# EAGLE design clock-converter (EAGLE 7.6.0)
REVISION: v1
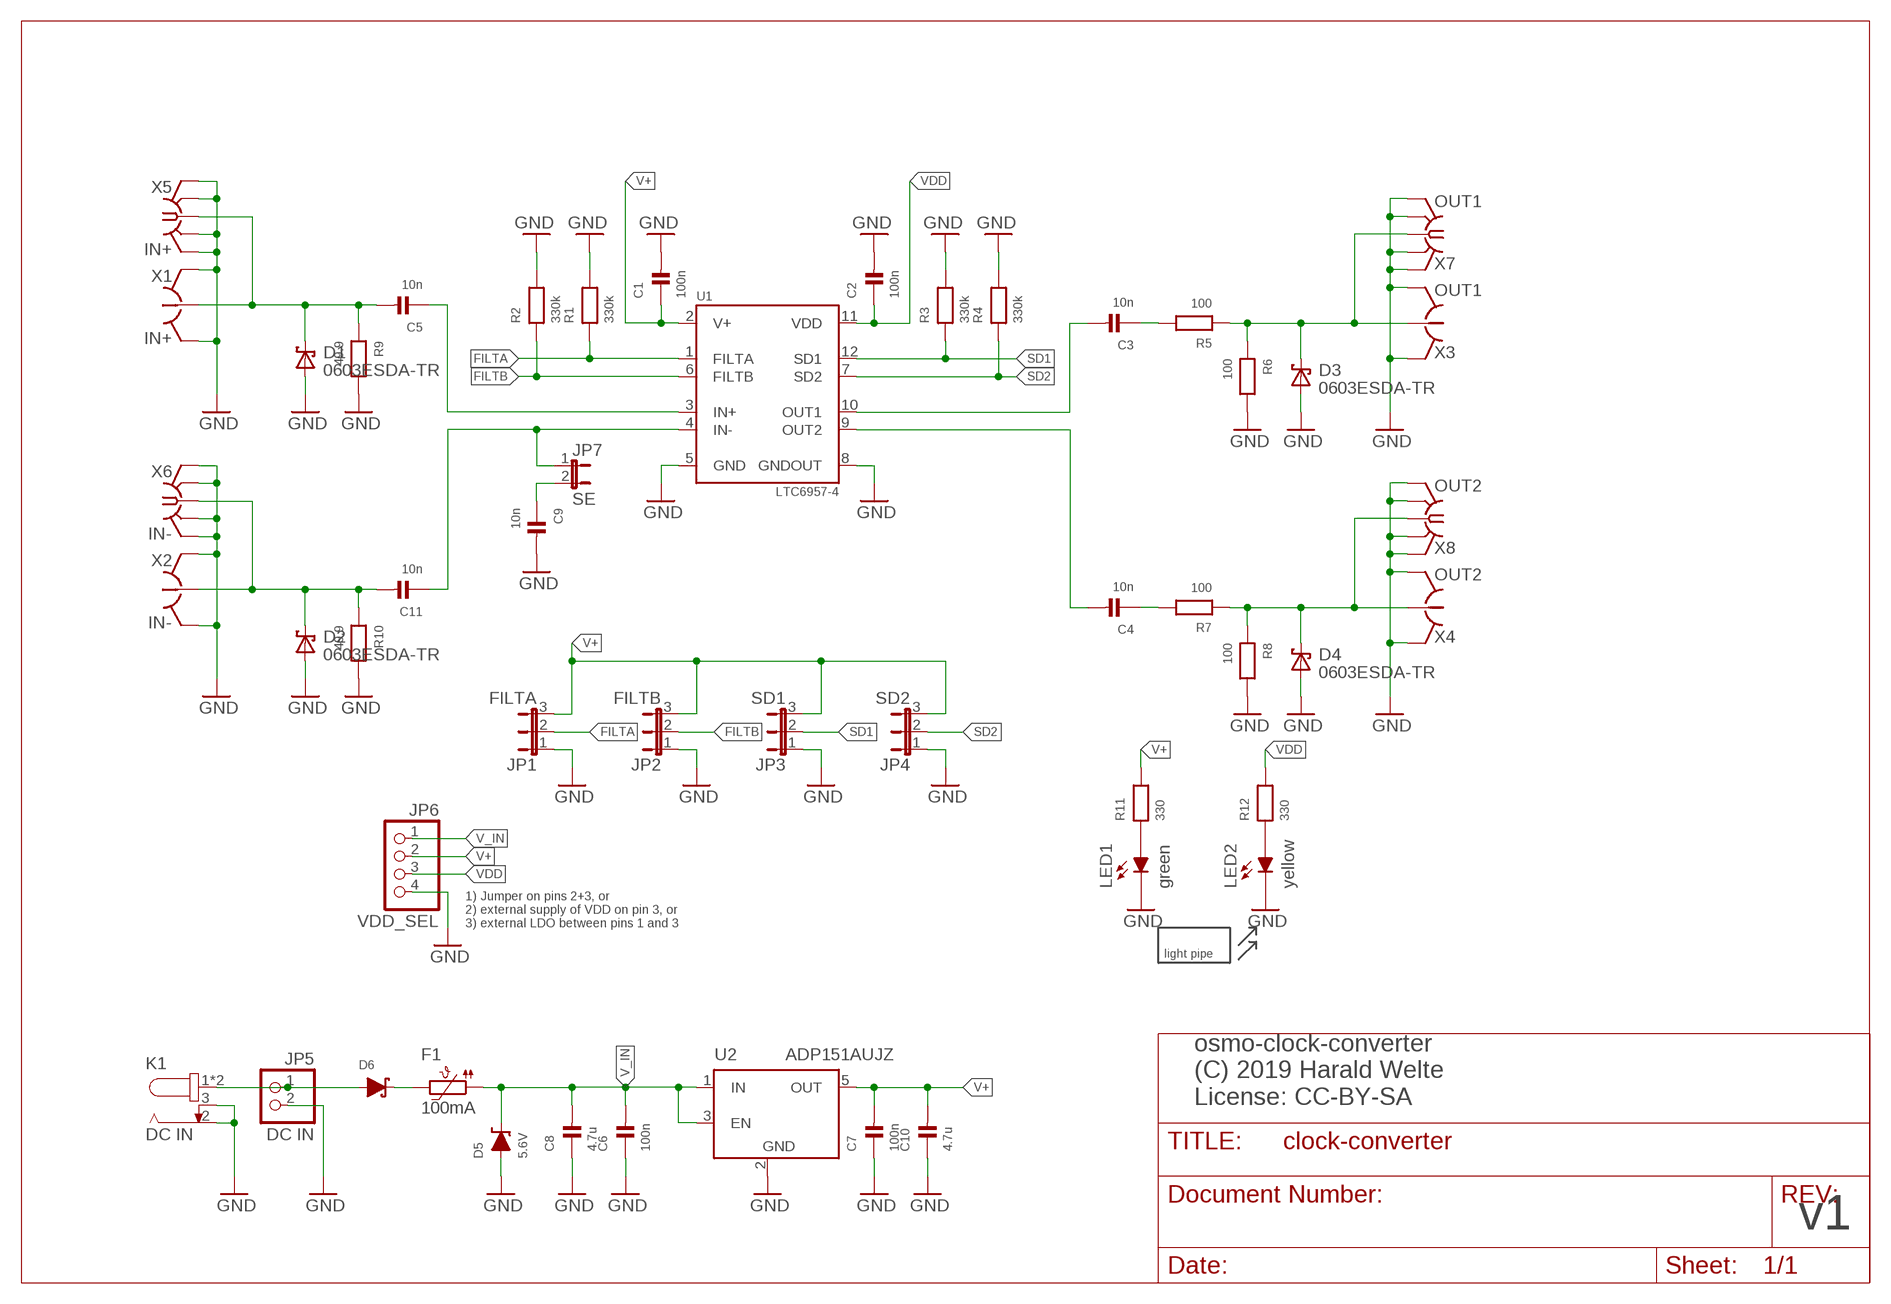
[diagram p0: schematic, sheet 1]

## Parts
C1  100n  CAP_CERAMIC_0603  [_0603]
C2  100n  CAP_CERAMIC_0603  [_0603]
C3  10n  CAP_CERAMIC_0603  [_0603]
C4  10n  CAP_CERAMIC_0603  [_0603]
C5  10n  CAP_CERAMIC_0603  [_0603]
C6  100n  CAP_CERAMIC_0603  [_0603]
C7  100n  CAP_CERAMIC_0603  [_0603]
C8  4.7u  CAP_CERAMIC_0805  [_0805]
C9  10n  CAP_CERAMIC_0603  [_0603]
C10  4.7u  CAP_CERAMIC_0805  [_0805]
C11  10n  CAP_CERAMIC_0603  [_0603]
D1  0603ESDA-TR  [0603]
D2  0603ESDA-TR  [0603]
D3  0603ESDA-TR  [0603]
D4  0603ESDA-TR  [0603]
D5  5.6V  DIODDE-ZENER-SMA  [SMADIODE]
D6  DIODE-SCHOTTKY-SMA  [SMADIODE]
F1  100mA  POLYFUSE-1206L  [1206L]
JP1  FILTA  JP2E  [JP2]
JP2  FILTB  JP2E  [JP2]
JP3  SD1  JP2E  [JP2]
JP4  SD2  JP2E  [JP2]
JP5  DC IN  PINHD-1X2  [1X02]
JP6  VDD_SEL  PINHD-1X4  [1X04]
JP7  SE  JP1E  [JP1]
K1  DC IN  694108106102  [694108106102]
LED1  green  LEDPLCC2-MIN  [PLCC2-MIN]
LED2  yellow  LEDPLCC2-MIN  [PLCC2-MIN]
M1  MENTOR_12701001  [1270.1001]
R1  330k  RESISTOR_0603  [_0603]
R2  330k  RESISTOR_0603  [_0603]
R3  330k  RESISTOR_0603  [_0603]
R4  330k  RESISTOR_0603  [_0603]
R5  100  RESISTOR_0603  [_0603]
R6  100  RESISTOR_0603  [_0603]
R7  100  RESISTOR_0603  [_0603]
R8  100  RESISTOR_0603  [_0603]
R9  49.9  RESISTOR_0603  [_0603]
R10  49.9  RESISTOR_0603  [_0603]
R11  330  RESISTOR_0603  [_0603]
R12  330  RESISTOR_0603  [_0603]
U1  LTC6957-4  LTC6957-3/4-HMS  [MSOP12]
U2  ADP151AUJZ  LDO_FIXED_EN-ADP151AUJZ  [SOT23L]
X1  IN+  HRS_UFL  [HRS_UFL]
X2  IN-  HRS_UFL  [HRS_UFL]
X3  OUT1  HRS_UFL  [HRS_UFL]
X4  OUT2  HRS_UFL  [HRS_UFL]
X5  IN+  SMA-F-S-TH  [SMA-F-S-TH]
X6  IN-  SMA-F-S-TH  [SMA-F-S-TH]
X7  OUT1  SMA-F-S-TH  [SMA-F-S-TH]
X8  OUT2  SMA-F-S-TH  [SMA-F-S-TH]

## Nets
FILTA: JP1.2 R1.1 U1.1(FILTA)
FILTB: JP2.2 R2.1 U1.6(FILTB)
GND [supply]: C1.2 C2.2 C6.1 C7.1 C8.1 C9.2 C10.1 D1.1(A) D2.1(A) D3.1(A) D4.1(A) D5.A JP1.1 JP2.1 JP3.1 JP4.1 JP5.2 JP6.4 K1.2 K1.3 LED1.K(C) LED2.K(C) R1.2 R2.2 R3.2 R4.2 R6.2 R8.2 R9.2 R10.2 U1.5(GND) U1.8(GNDOUT) U2.2(GND) X1.GND@1(GND) X1.GND@2(GND) X2.GND@1(GND) X2.GND@2(GND) X3.GND@1(GND) X3.GND@2(GND) X4.GND@1(GND) X4.GND@2(GND) X5.G1(GND) X5.G2(GND) X5.G3(GND) X5.G4(GND) X6.G1(GND) X6.G2(GND) X6.G3(GND) X6.G4(GND) X7.G1(GND) X7.G2(GND) X7.G3(GND) X7.G4(GND) X8.G1(GND) X8.G2(GND) X8.G3(GND) X8.G4(GND)
IN+ [50ohms]: C5.1 U1.3(IN+)
N$1: LED1.A R11.1
N$2 [50ohms]: C3.2 U1.10(OUT1)
N$3: LED2.A R12.1
N$4: C9.1 JP7.2
N$5 [supply]: D6.C F1.2
N$6 [50ohms]: C3.1 R5.2
N$7 [50ohms]: C11.1 JP7.1 U1.4(IN-)
N$8 [50ohms]: C4.2 U1.9(OUT2)
N$9 [50ohms]: C4.1 R7.2
N$10 [50ohms]: C11.2 D2.2(K) R10.1 X2.SIG X6.C
N$12 [50ohms]: C5.2 D1.2(K) R9.1 X1.SIG X5.C
N$14 [supply]: D6.A JP5.1 K1.1 K1.1-1
OUT1 [50ohms]: D3.2(K) R5.1 R6.1 X3.SIG X7.C
OUT2 [50ohms]: D4.2(K) R7.1 R8.1 X4.SIG X8.C
SD1: JP3.2 R3.1 U1.12(SD1)
SD2: JP4.2 R4.1 U1.7(SD2)
V+ [supply]: C1.1 C7.2 C10.2 JP1.3 JP2.3 JP3.3 JP4.3 JP6.2 R11.2 U1.2(V+) U2.5(OUT)
V_IN [supply]: C6.2 C8.2 D5.C F1.1 JP6.1 U2.1(IN) U2.3(EN)
VDD [supply]: C2.1 JP6.3 R12.2 U1.11(VDD)

## Notes on the sheet
- 1) Jumper on pins 2+3, or
  2) external supply of VDD on pin 3, or
  3) external LDO between pins 1 and 3
- osmo-clock-converter
  (C) 2019 Harald Welte
  License: CC-BY-SA

## Library data of the parts
C1 C2 C6 C7 = rc-sysmocom:CAP_CERAMIC: Ceramic Capacitors 0402 - 0402 Surface Mount Capacitors 16pF 50V 5% [Digikey: 445-4899-2-ND] 18pF 50V 5% [Digikey: 490-1281-2-ND] 22pF 50V 5% [Digikey: 490-1283-2-ND] 68pF 50V 5% [Digikey: 490-1289-2-ND] 0.1uF 10V 10% [Digikey: 490-1318-2-ND] 1.0uF 6.3V 10% [Digikey: 490-1320-2-ND] 0603 - 0603 Surface Mount Capacitors 16 pF 50V 5% [Digikey: 445-5051-2-ND] 22 pF 50V [Digikey: PCC220ACVTR-ND] 33 pF 50V 5% [Digikey: 490-1415-1-ND] 56pF 50V 5% [Digikey: 490-1421-1-ND] 220pF 50V 5% [Digikey: 445-1285-1-ND] 680 pF 50V 2200 pF 50V 5% C0G [Digikey: 445-1297-1-ND] 5600 pF 100V 5% X7R [Digikey: 478-3711-1-ND] 0.1 µF 25V 10% [Digikey: PCC2277TR-ND] 0.22 µF 16V 10% X7R [Digikey: 445-1318-1-ND] 1.0 µF 25V 10% [Digikey: 445-5146-2-ND] 0603 - RF Specific 3pF 250V +/-0.1pF RF [Digikey: 712-1347-1-ND] 18 pF 250V 5% [Digikey: 478-3505-1-ND or 712-1322-1-ND] 56 pF 250V 5% C0G RF [Digikey: 490-4867-1-ND] 68 pF 250V RF [Digikey: 490-4868-1-ND] 0805 - 0805 Surface Mount Capacitors 220 pF 250V 2% RF Ceramic Capacitor [Digikey: 712-1398-1-ND] 1000 pF 50V 2% NP0 Ceramic Capacitor [Digikey: 478-3760-1-ND] 0.1 µF 25V 10% Ceramic Capacitor [Digikey: PCC1828TR-ND] 1.0 µF 16V 10% Ceramic Capacitor[Digikey: 490-1691-2-ND] 10.0 µF 10V 10% Ceramic Capacitor[Digikey: 709-1228-1-ND] 10.0 uF 16V 10% Ceramic Capacitor [Digikey: 478-5165-2-ND] 47 uF 6.3V 20% Ceramic Capacitor [Digikey: 587-1779-1-ND or 399-5506-1-ND] 1206 - 1206 Surface Mount Capacitors 47uF 10V 20% Ceramic Capacitor [Digikey: 490-5528-1-ND or 399-5508-1-ND or 445-6010-1-ND] 100uF 6.3V -20%, +80% Y5V Ceramic Capacitor (Digikey: 490-4512-1-ND, Mouser: 81-GRM31CF50J107ZE1L) 1810 - 1810 Surface Mount Capacitors High volt MLC; no solder stop between for higher isolation; CLASS: CAPACITOR; DESCRIPTION: CAP CER 0.1UF 16V X7R 0603; LINK: https://www.digikey.de/product-detail/de/samsung-electro-mechanics/CL10B104KO8NNNC/1276-1005-1-ND/3889091; MANUFACTURER: Samsung Electro-Mechanics; MANUFACTURERPARTNUMBER: CL10B104KO8NNNC; POPULATED: TRUE; ROHSCERTIFICATE: Bleifrei / RoHS-konform; SOURCE: DIGIKEY; SOURCEPARTNUMBER: 1276-1005-1-ND
C3-C5 C9 C11 = rc-sysmocom:CAP_CERAMIC: Ceramic Capacitors 0402 - 0402 Surface Mount Capacitors 16pF 50V 5% [Digikey: 445-4899-2-ND] 18pF 50V 5% [Digikey: 490-1281-2-ND] 22pF 50V 5% [Digikey: 490-1283-2-ND] 68pF 50V 5% [Digikey: 490-1289-2-ND] 0.1uF 10V 10% [Digikey: 490-1318-2-ND] 1.0uF 6.3V 10% [Digikey: 490-1320-2-ND] 0603 - 0603 Surface Mount Capacitors 16 pF 50V 5% [Digikey: 445-5051-2-ND] 22 pF 50V [Digikey: PCC220ACVTR-ND] 33 pF 50V 5% [Digikey: 490-1415-1-ND] 56pF 50V 5% [Digikey: 490-1421-1-ND] 220pF 50V 5% [Digikey: 445-1285-1-ND] 680 pF 50V 2200 pF 50V 5% C0G [Digikey: 445-1297-1-ND] 5600 pF 100V 5% X7R [Digikey: 478-3711-1-ND] 0.1 µF 25V 10% [Digikey: PCC2277TR-ND] 0.22 µF 16V 10% X7R [Digikey: 445-1318-1-ND] 1.0 µF 25V 10% [Digikey: 445-5146-2-ND] 0603 - RF Specific 3pF 250V +/-0.1pF RF [Digikey: 712-1347-1-ND] 18 pF 250V 5% [Digikey: 478-3505-1-ND or 712-1322-1-ND] 56 pF 250V 5% C0G RF [Digikey: 490-4867-1-ND] 68 pF 250V RF [Digikey: 490-4868-1-ND] 0805 - 0805 Surface Mount Capacitors 220 pF 250V 2% RF Ceramic Capacitor [Digikey: 712-1398-1-ND] 1000 pF 50V 2% NP0 Ceramic Capacitor [Digikey: 478-3760-1-ND] 0.1 µF 25V 10% Ceramic Capacitor [Digikey: PCC1828TR-ND] 1.0 µF 16V 10% Ceramic Capacitor[Digikey: 490-1691-2-ND] 10.0 µF 10V 10% Ceramic Capacitor[Digikey: 709-1228-1-ND] 10.0 uF 16V 10% Ceramic Capacitor [Digikey: 478-5165-2-ND] 47 uF 6.3V 20% Ceramic Capacitor [Digikey: 587-1779-1-ND or 399-5506-1-ND] 1206 - 1206 Surface Mount Capacitors 47uF 10V 20% Ceramic Capacitor [Digikey: 490-5528-1-ND or 399-5508-1-ND or 445-6010-1-ND] 100uF 6.3V -20%, +80% Y5V Ceramic Capacitor (Digikey: 490-4512-1-ND, Mouser: 81-GRM31CF50J107ZE1L) 1810 - 1810 Surface Mount Capacitors High volt MLC; no solder stop between for higher isolation; CLASS: CAPACITOR; DESCRIPTION: CAP CER 10000PF 50V X7R 0603; LINK: https://www.digikey.de/product-detail/de/kemet/C0603C103M5RACTU/399-7842-1-ND/3471565; MANUFACTURER: KEMET; MANUFACTURERPARTNUMBER: C0603C103M5RACTU; POPULATED: TRUE; ROHSCERTIFICATE: Bleifrei / RoHS-konform; SOURCE: DIGIKEY; SOURCEPARTNUMBER: 399-7842-1-ND
C8 C10 = rc-sysmocom:CAP_CERAMIC: Ceramic Capacitors 0402 - 0402 Surface Mount Capacitors 16pF 50V 5% [Digikey: 445-4899-2-ND] 18pF 50V 5% [Digikey: 490-1281-2-ND] 22pF 50V 5% [Digikey: 490-1283-2-ND] 68pF 50V 5% [Digikey: 490-1289-2-ND] 0.1uF 10V 10% [Digikey: 490-1318-2-ND] 1.0uF 6.3V 10% [Digikey: 490-1320-2-ND] 0603 - 0603 Surface Mount Capacitors 16 pF 50V 5% [Digikey: 445-5051-2-ND] 22 pF 50V [Digikey: PCC220ACVTR-ND] 33 pF 50V 5% [Digikey: 490-1415-1-ND] 56pF 50V 5% [Digikey: 490-1421-1-ND] 220pF 50V 5% [Digikey: 445-1285-1-ND] 680 pF 50V 2200 pF 50V 5% C0G [Digikey: 445-1297-1-ND] 5600 pF 100V 5% X7R [Digikey: 478-3711-1-ND] 0.1 µF 25V 10% [Digikey: PCC2277TR-ND] 0.22 µF 16V 10% X7R [Digikey: 445-1318-1-ND] 1.0 µF 25V 10% [Digikey: 445-5146-2-ND] 0603 - RF Specific 3pF 250V +/-0.1pF RF [Digikey: 712-1347-1-ND] 18 pF 250V 5% [Digikey: 478-3505-1-ND or 712-1322-1-ND] 56 pF 250V 5% C0G RF [Digikey: 490-4867-1-ND] 68 pF 250V RF [Digikey: 490-4868-1-ND] 0805 - 0805 Surface Mount Capacitors 220 pF 250V 2% RF Ceramic Capacitor [Digikey: 712-1398-1-ND] 1000 pF 50V 2% NP0 Ceramic Capacitor [Digikey: 478-3760-1-ND] 0.1 µF 25V 10% Ceramic Capacitor [Digikey: PCC1828TR-ND] 1.0 µF 16V 10% Ceramic Capacitor[Digikey: 490-1691-2-ND] 10.0 µF 10V 10% Ceramic Capacitor[Digikey: 709-1228-1-ND] 10.0 uF 16V 10% Ceramic Capacitor [Digikey: 478-5165-2-ND] 47 uF 6.3V 20% Ceramic Capacitor [Digikey: 587-1779-1-ND or 399-5506-1-ND] 1206 - 1206 Surface Mount Capacitors 47uF 10V 20% Ceramic Capacitor [Digikey: 490-5528-1-ND or 399-5508-1-ND or 445-6010-1-ND] 100uF 6.3V -20%, +80% Y5V Ceramic Capacitor (Digikey: 490-4512-1-ND, Mouser: 81-GRM31CF50J107ZE1L) 1810 - 1810 Surface Mount Capacitors High volt MLC; no solder stop between for higher isolation; CLASS: CAPACITOR; DESCRIPTION: CAP CER 4.7UF 16V X5R 0805; LINK: https://www.digikey.de/product-detail/de/samsung-electro-mechanics/CL21A475KOFNNNE/1276-1065-1-ND/3889151; MANUFACTURER: Samsung Electro-Mechanics; MANUFACTURERPARTNUMBER: CL21A475KOFNNNE; POPULATED: TRUE; ROHSCERTIFICATE: Bleifrei / RoHS-konform; SOURCE: DIGIKEY; SOURCEPARTNUMBER: 1276-1065-1-ND
D1-D4 = laforge:0603ESDA-TR: Bussmann 0603ESDA-TR ESD Suppressor; CLASS: DIODE; DESCRIPTION: SUPPRESSOR ESD 30VDC 0603 SMD; LINK: https://www.digikey.de/product-detail/de/eaton-electronics-division/0603ESDA2-TR2/283-4156-1-ND/3681415; MANUFACTURER: Eaton - Electronics Division; MANUFACTURERPARTNUMBER: 0603ESDA2-TR2; POPULATED: TRUE; ROHSCERTIFICATE: Bleifrei / RoHS-konform; SOURCE: DIGIKEY; SOURCEPARTNUMBER: 283-4156-1-ND
D5 = diodes-sysmocom:DIODDE-ZENER; CLASS: DIODE; DESCRIPTION: DIODE ZENER 5.6V 3W DO214AC; LINK: https://www.digikey.de/product-detail/de/micro-commercial-co/3SMAJ5919B-TP/3SMAJ5919B-TPMSCT-ND/1793296; MANUFACTURER: Micro Commercial Co; MANUFACTURERPARTNUMBER: 3SMAJ5919B-TP; POPULATED: TRUE; ROHSCERTIFICATE: Bleifrei / RoHS-konform; SOURCE: DIGIKEY; SOURCEPARTNUMBER: 3SMAJ5919B-TPMSCT-ND
D6 = diodes-sysmocom:DIODE-SCHOTTKY: Diode SMA Model Volts Amps Type Vf Vr Digikey # Notes SSA34-E3 40V 3A Schottky 480mV @ 3A 200uA @ 40V SSA34-E3/61TGITR-ND CDBA120-G 20V 1A Schottky 500mV @ 1A 500uA @ 20V 641-1014-6-ND REEL MBRA210 10V 2A Schottky 350mV @ 2A 700uA @ 10V MBRA210LT3 SOD-123 Model Volts Amps Type Vf Vr Order # Notes BAT54T1G 30V 200mA Schottky 800mV @ 200mA 2uA @ 25V BAT54T1GOSTR-ND B0530W 30V 500mA Schottky 430mV @ 500mA 130uA @ 30V B0530W-FDICT-ND REEL MBR120 1A 20V Schottky 340mV @ 1A MBR120VLSFT1GOSCT-ND SOD-323 Model Volts Amps Type Vf Vr Order # Notes PMEG2005EJ 20V 500mA Schottky 355mV @ 500mA 568-4110-1-ND ZLLS410 10V 570mA Schottky 380mV @ 570mA ZLLS410CT-ND 1N4148WS 75V 150mA Silicon/Simple 1V 1N4148WSFSCT-ND REEL SOD-523 Model Volts Amps Type Vf Vr Order # Notes BAT54XV2 30V 200mA Schottky 0.8V @ 100mA BAT54XV2CT-ND TB751S 30V 30mA Schottky RB751S-40TE61CT-ND SOT23-R/W (R = Solder Paste/Reflow Ovens, W = Hand-Soldering) Model Volts Amps Type Vf Vr Order # Notes BAT54FILM 40V 300mA Schottky 497-7162-1-ND; CLASS: DIODE; DESCRIPTION: DIODE SCHOTTKY 30V 800MA USC; LINK: https://www.digikey.de/product-detail/de/toshiba-semiconductor-and-storage/CUS08F30H3F/CUS08F30H3FCT-ND/5114376; MANUFACTURER: Toshiba Semiconductor and Storage; MANUFACTURERPARTNUMBER: CUS08F30,H3F; POPULATED: TRUE; ROHSCERTIFICATE: Bleifrei / RoHS-konform; SOURCE: DIGIKEY; SOURCEPARTNUMBER: CUS08F30H3FCT-ND
F1 = littlefuse:POLYFUSE; CLASS: UNKNOWN CLASS; DESCRIPTION: PTC RESET FUSE 30V 200MA 1206; LINK: https://www.digikey.de/product-detail/de/0ZCJ0020FF2E/507-1797-1-ND/4156228/?itemSeq=282618602; MANUFACTURER: Bel Fuse Inc.; MANUFACTURERPARTNUMBER: 0ZCJ0020FF2E; POPULATED: TRUE; ROHSCERTIFICATE: Bleifrei / RoHS-konform; SOURCE: DIGIKEY; SOURCEPARTNUMBER: 507-1797-1-ND
JP1-JP4 = jumper:JP2E: JUMPER; CLASS: CONNECTOR\JUMPER; DESCRIPTION: CONN HEADER VERT 3POS 2.54MM; LINK: https://www.digikey.de/product-detail/de/wurth-electronics-inc/61300311121/732-5316-ND/4846825; MANUFACTURER: Wurth Electronics Inc.; MANUFACTURERPARTNUMBER: 61300311121; POPULATED: TRUE; ROHSCERTIFICATE: Bleifrei / RoHS-konform; SOURCE: DIGIKEY; SOURCEPARTNUMBER: 732-5316-ND
JP5 = laforge:PINHD-1X2: PIN HEADER; CLASS: CONNECTOR\JUMPER; DESCRIPTION: CONN HEADER VERT 2POS 2.54MM; LINK: https://www.digikey.de/product-detail/de/PREC002SAAN-RC/S1012EC-02-ND/2774852; MANUFACTURER: Sullins Connector Solutions; MANUFACTURERPARTNUMBER: PREC002SAAN-RC; POPULATED: TRUE; ROHSCERTIFICATE: Bleifrei / RoHS-konform; SOURCE: DIGIKEY; SOURCEPARTNUMBER: S1012EC-02-ND
JP6 = pinhead:PINHD-1X4: PIN HEADER; CLASS: CONNECTOR\JUMPER; DESCRIPTION: CONN HEADER VERT 4POS 2.54MM; LINK: https://www.digikey.de/product-detail/de/sullins-connector-solutions/PRPC004SAAN-RC/S1011EC-04-ND/2775250; MANUFACTURER: Sullins Connector Solutions; MANUFACTURERPARTNUMBER: PRPC004SAAN-RC; POPULATED: TRUE; ROHSCERTIFICATE: Bleifrei / RoHS-konform; SOURCE: DIGIKEY; SOURCEPARTNUMBER: S1011EC-04-ND
JP7 = jumper:JP1E: JUMPER; CLASS: CONNECTOR\JUMPER; DESCRIPTION: CONN HEADER VERT 2POS 2.54MM; LINK: https://www.digikey.de/product-detail/de/PREC002SAAN-RC/S1012EC-02-ND/2774852; MANUFACTURER: Sullins Connector Solutions; MANUFACTURERPARTNUMBER: PREC002SAAN-RC; POPULATED: TRUE; ROHSCERTIFICATE: Bleifrei / RoHS-konform; SOURCE: DIGIKEY; SOURCEPARTNUMBER: S1012EC-02-ND
K1 = Wurth_Elektronik_Electromechanic_DC_Power_Jack_Connectors_rev15c:694108106102: WR-DC_DC Power Jack_Right Angled_SMT Center Pin Ø2.5_Plug ID Ø2.55_Plug OD Ø5.5_with 4 Soldering Pad & Peg ;=>Code : Con_WR-DC_SMT_694108106102_694108106102 <http://katalog.we-online.de/media/images/eican/Con_WR-DC_SMT_694108106102_pf2.jpg> Details see: http://katalog.we-online.de/em/datasheet/6941xx106102.pdf Created 2014-10-08, Karrer Zheng 2014 (C) Wurth Elektronik; CLASS: RELAY; DESCRIPTION: CONN PWR JACK 2.5X5.5MM SOLDER; LINK: http://www.digikey.de/product-detail/de/wurth-electronics-inc/694108106102/732-5933-1-ND/5047628; MANUFACTURER: Wurth Electronics Inc.; MANUFACTURERPARTNUMBER: 694108106102; POPULATED: TRUE; ROHSCERTIFICATE: Bleifrei / RoHS-konform; SOURCE: DIGIKEY; SOURCEPARTNUMBER: 732-5933-1-ND
LED1 = LED-PLCC2:LED: OSRAM types LY T676, LS T670 in P-LLC2 package side-LED types LY A676, LS A676; CLASS: LED; DESCRIPTION: LED GREEN CLEAR 2PLCC SMD; LINK: https://www.digikey.de/product-detail/de/osram-opto-semiconductors-inc/LG-T67F-R1T1-24/475-3413-1-ND/7908021; MANUFACTURER: OSRAM Opto Semiconductors Inc.; MANUFACTURERPARTNUMBER: LG T67F-R1T1-24; POPULATED: TRUE; ROHSCERTIFICATE: Bleifrei / RoHS-konform; SOURCE: DIGIKEY; SOURCEPARTNUMBER: 475-3413-1-ND
LED2 = LED-PLCC2:LED: OSRAM types LY T676, LS T670 in P-LLC2 package side-LED types LY A676, LS A676; CLASS: LED; DESCRIPTION: LED YELLOW CLEAR 2PLCC SMD; LINK: https://www.digikey.de/product-detail/de/osram-opto-semiconductors-inc/LY-T676-S1T1-26-Z/475-2665-1-ND; MANUFACTURER: OSRAM Opto Semiconductors Inc.; MANUFACTURERPARTNUMBER: LY T676-S1T1-26-Z; POPULATED: TRUE; ROHSCERTIFICATE: Bleifrei / RoHS-konform; SOURCE: DIGIKEY; SOURCEPARTNUMBER: 475-2665-1-ND
M1 = Mentor_lightpipe:MENTOR_12701001: MENTOR 1270.1001, PCB Mounted 2-Way Right Angle LED Light Pipe, Bi-Level Clear Round Lens; CLASS: UNKNOWN CLASS; DESCRIPTION: NO DESCRIPTION; LINK: UNKNOWN LINK; MANUFACTURER: UNKNOWN MANUFACTURER; MANUFACTURERPARTNUMBER: UNKNOWN MANUFACTURER PART NUMBER; POPULATED: TRUE; ROHSCERTIFICATE: UNKNOWN ROHS CERTIFICATE; SOURCE: UNKNOWN SOURCE; SOURCEPARTNUMBER: UNKNOWN SOURCE PART NUMBER
R1-R4 = rc-sysmocom:RESISTOR: Resistors 0402 - 0402 Surface Mount Package 22 Ohm 1% 1/16W [Digikey: 311-22.0LRTR-ND] 33 Ohm 5% 1/16W 1.0K 5% 1/16W 1.5K 5% 1/16W 2.0K 1% 1/16W 10.0K 1% 1/16W [Digikey: 311-10.0KLRTR-ND] 10.0K 5% 1/16W [Digikey: RMCF0402JT10K0TR-ND] 12.1K 1% 1/16W [Digikey: 311-22.0LRTR-ND] 100.0K 5% 1/16W 0603 - 0603 Surface Mount Package 1/10 Watt 0805 - 0805 Surface Mount Package 1/8 Watt 1206 - 1206 Surface Mount Package 2012 - 2010 Surface Mount Package 0.11 Ohm 1/2 Watt 1% Resistor - Digikey: RHM.11UCT-ND; CLASS: RESISTOR; DESCRIPTION: RES 330K OHM 5%% 1/10W 0603; LINK: https://www.digikey.de/product-detail/de/stackpole-electronics-inc/RMCF0603JG330K/RMCF0603JG330KCT-ND/6053832; MANUFACTURER: Stackpole Electronics Inc; MANUFACTURERPARTNUMBER: RMCF0603JG330K; POPULATED: TRUE; ROHSCERTIFICATE: Bleifrei / RoHS-konform; SOURCE: DIGIKEY; SOURCEPARTNUMBER: RMCF0603JG330KCT-ND
R5-R8 = rc-sysmocom:RESISTOR: Resistors 0402 - 0402 Surface Mount Package 22 Ohm 1% 1/16W [Digikey: 311-22.0LRTR-ND] 33 Ohm 5% 1/16W 1.0K 5% 1/16W 1.5K 5% 1/16W 2.0K 1% 1/16W 10.0K 1% 1/16W [Digikey: 311-10.0KLRTR-ND] 10.0K 5% 1/16W [Digikey: RMCF0402JT10K0TR-ND] 12.1K 1% 1/16W [Digikey: 311-22.0LRTR-ND] 100.0K 5% 1/16W 0603 - 0603 Surface Mount Package 1/10 Watt 0805 - 0805 Surface Mount Package 1/8 Watt 1206 - 1206 Surface Mount Package 2012 - 2010 Surface Mount Package 0.11 Ohm 1/2 Watt 1% Resistor - Digikey: RHM.11UCT-ND; CLASS: RESISTOR; DESCRIPTION: RES 100 OHM 5%% 1/10W 0603; LINK: https://www.digikey.de/product-detail/de/stackpole-electronics-inc/RMCF0603JT100R/RMCF0603JT100RCT-ND/1943156; MANUFACTURER: Stackpole Electronics Inc; MANUFACTURERPARTNUMBER: RMCF0603JT100R; POPULATED: TRUE; ROHSCERTIFICATE: Bleifrei / RoHS-konform; SOURCE: DIGIKEY; SOURCEPARTNUMBER: RMCF0603JT100RCT-ND
R9 R10 = rc-sysmocom:RESISTOR: Resistors 0402 - 0402 Surface Mount Package 22 Ohm 1% 1/16W [Digikey: 311-22.0LRTR-ND] 33 Ohm 5% 1/16W 1.0K 5% 1/16W 1.5K 5% 1/16W 2.0K 1% 1/16W 10.0K 1% 1/16W [Digikey: 311-10.0KLRTR-ND] 10.0K 5% 1/16W [Digikey: RMCF0402JT10K0TR-ND] 12.1K 1% 1/16W [Digikey: 311-22.0LRTR-ND] 100.0K 5% 1/16W 0603 - 0603 Surface Mount Package 1/10 Watt 0805 - 0805 Surface Mount Package 1/8 Watt 1206 - 1206 Surface Mount Package 2012 - 2010 Surface Mount Package 0.11 Ohm 1/2 Watt 1% Resistor - Digikey: RHM.11UCT-ND; CLASS: RESISTOR; DESCRIPTION: RES 49.9 OHM 1%% 1/10W 0603; LINK: https://www.digikey.de/product-detail/de/stackpole-electronics-inc/RMCF0603FT49R9/RMCF0603FT49R9CT-ND/1942956; MANUFACTURER: Stackpole Electronics Inc; MANUFACTURERPARTNUMBER: RMCF0603FT49R9; POPULATED: TRUE; ROHSCERTIFICATE: Bleifrei / RoHS-konform; SOURCE: DIGIKEY; SOURCEPARTNUMBER: RMCF0603FT49R9CT-ND
R11 R12 = rc-sysmocom:RESISTOR: Resistors 0402 - 0402 Surface Mount Package 22 Ohm 1% 1/16W [Digikey: 311-22.0LRTR-ND] 33 Ohm 5% 1/16W 1.0K 5% 1/16W 1.5K 5% 1/16W 2.0K 1% 1/16W 10.0K 1% 1/16W [Digikey: 311-10.0KLRTR-ND] 10.0K 5% 1/16W [Digikey: RMCF0402JT10K0TR-ND] 12.1K 1% 1/16W [Digikey: 311-22.0LRTR-ND] 100.0K 5% 1/16W 0603 - 0603 Surface Mount Package 1/10 Watt 0805 - 0805 Surface Mount Package 1/8 Watt 1206 - 1206 Surface Mount Package 2012 - 2010 Surface Mount Package 0.11 Ohm 1/2 Watt 1% Resistor - Digikey: RHM.11UCT-ND; CLASS: RESISTOR; DESCRIPTION: RES 330 OHM 5%% 1/10W 0603; LINK: https://www.digikey.de/product-detail/de/stackpole-electronics-inc/RMCF0603JT330R/RMCF0603JT330RCT-ND/1943164; MANUFACTURER: Stackpole Electronics Inc; MANUFACTURERPARTNUMBER: RMCF0603JT330R; POPULATED: TRUE; ROHSCERTIFICATE: Bleifrei / RoHS-konform; SOURCE: DIGIKEY; SOURCEPARTNUMBER: RMCF0603JT330RCT-ND
U1 = cdclvc-clockbuf:LTC6957-3/4: LTC6957-1/LTC6957-2/LTC6957-3/LTC6957-4 Low Phase Noise, Dual Output Buffer/Driver/Logic Converter; CLASS: IC; DESCRIPTION: IC CLK BUFFER DVR 1:2 12MSOP; LINK: https://www.digikey.de/product-detail/de/linear-technology-analog-devices/LTC6957IMS-3-PBF/LTC6957IMS-3-PBF-ND/3973487; MANUFACTURER: Linear Technology/Analog Devices; MANUFACTURERPARTNUMBER: LTC6957IMS-3#PBF; POPULATED: TRUE; ROHSCERTIFICATE: Bleifrei / RoHS-konform; SOURCE: DIGIKEY; SOURCEPARTNUMBER: LTC6957IMS-3#PBF-ND
U2 = ldo:LDO_FIXED_EN: High-Performance Single 150mA LDO; CLASS: IC; DESCRIPTION: IC REG LINEAR 3V 200MA TSOT5; LINK: https://www.digikey.de/product-detail/de/analog-devices-inc/ADP151AUJZ-3.0-R7/ADP151AUJZ-3.0-R7CT-ND/2334207; MANUFACTURER: Analog Devices Inc.; MANUFACTURERPARTNUMBER: ADP151AUJZ-3.0-R7; POPULATED: TRUE; ROHSCERTIFICATE: Bleifrei / RoHS-konform; SOURCE: DIGIKEY; SOURCEPARTNUMBER: ADP151AUJZ-3.0-R7CT-ND
X1-X4 = laforge:HRS_UFL: Hirose U.FL SMT; CLASS: CONNECTOR; DESCRIPTION: CONN U.FL RCPT STR 50 OHM SMD; LINK: https://www.digikey.de/product-detail/de/hirose-electric-co-ltd/U.FL-R-SMT-10/H9161CT-ND/2135256; MANUFACTURER: Hirose Electric Co Ltd; MANUFACTURERPARTNUMBER: U.FL-R-SMT(10); OC_DIGIKEY: H9161CT-ND; POPULATED: TRUE; ROHSCERTIFICATE: Bleifrei / RoHS-konform; SOURCE: DIGIKEY; SOURCEPARTNUMBER: H9161CT-ND
X5-X8 = laforge:SMA-F; CLASS: CONNECTOR; DESCRIPTION: CONN SMA JACK R/A 50 OHM PCB; LINK: https://www.digikey.de/product-detail/de/te-connectivity-amp-connectors/619540-1/A120734-ND/5021655; MANUFACTURER: TE Connectivity AMP Connectors; MANUFACTURERPARTNUMBER: 619540-1; POPULATED: TRUE; ROHSCERTIFICATE: Bleifrei / RoHS-konform; SOURCE: DIGIKEY; SOURCEPARTNUMBER: A120734-ND

## Net classes
1 50ohms: width 1.1 mm, clearance 0.2 mm
3 usb: width 0.6 mm, drill 0.2 mm, clearance 0.2 mm
4 gnd-poly: width 0.4 mm, drill 0.2 mm, clearance 0.3 mm

## Board
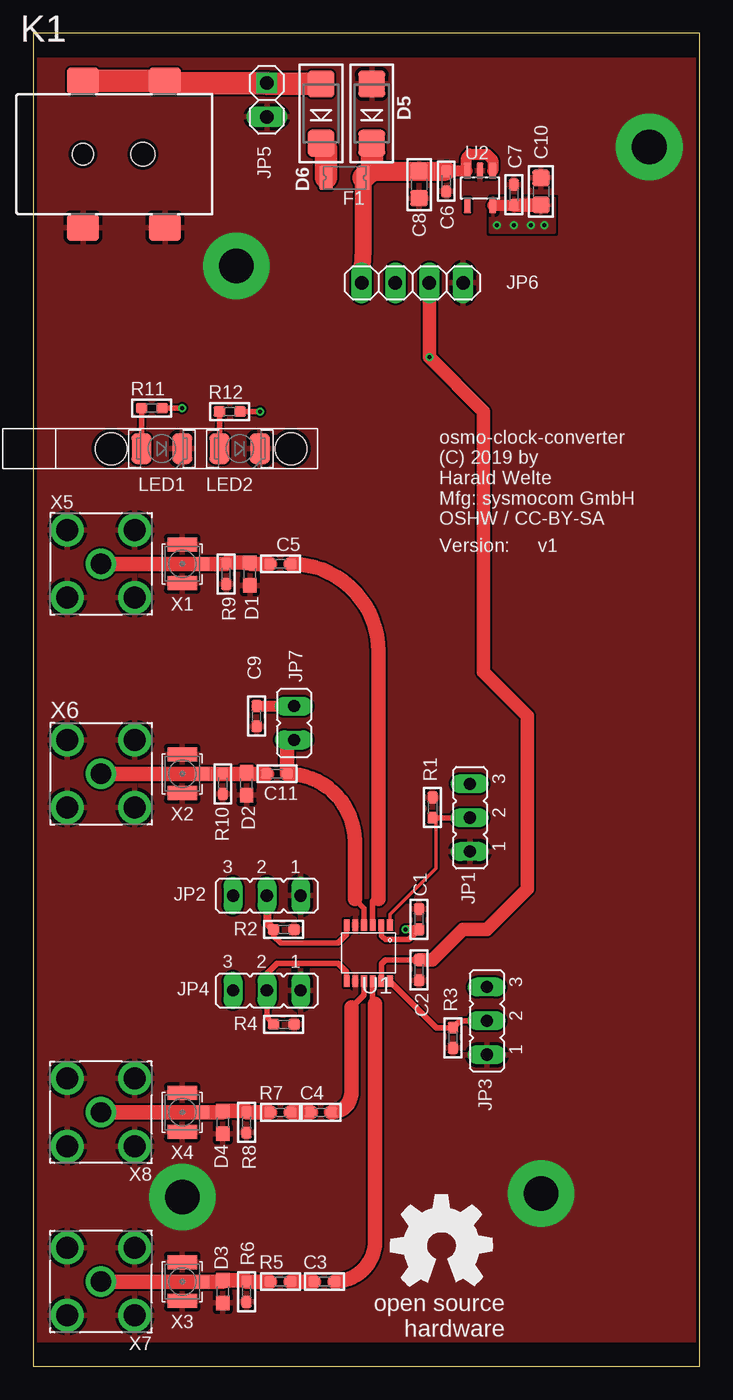
[diagram p1: board, top side]
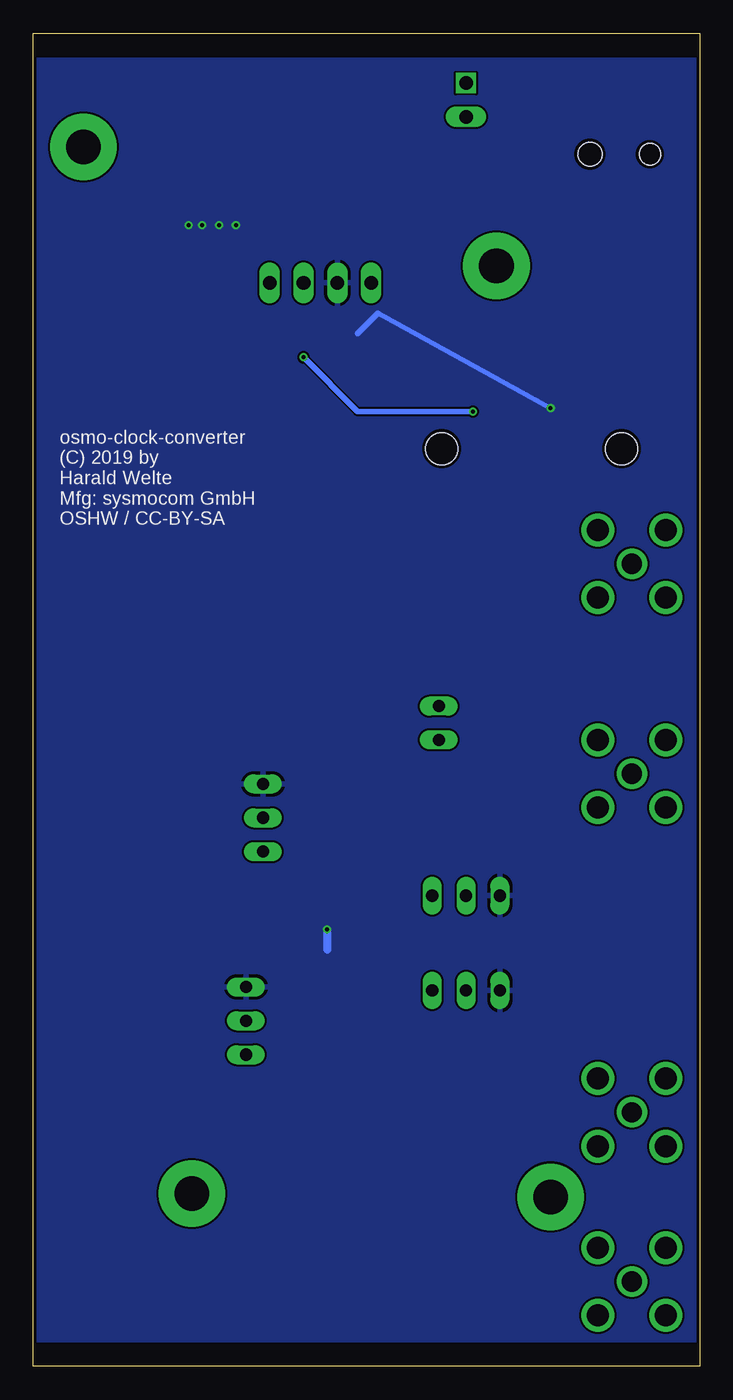
[diagram p2: board, bottom side, seen from below]

Size 50 x 100 mm. Coordinates in mm from the lower left corner, seen from the top.
Outline: 0,0 50,0 50,100 0,100 0,0
Copper layers (1*16): Top 0.035mm / dielectric 1.5mm / Bottom 0.035mm
Design rules "SeeedStudio_2layer_DRU_no_angle_20140221 *": minimum track width 6mil, minimum drill 0.3mm, track to track 6mil, track to pad 6mil, pad to pad 6mil, via to via 6mil, smd to smd 0mil, copper to edge 10mil, drill to drill 10mil, minimum pad ring 10mil, minimum via ring 6mil, stop-mask expansion 2mil, vias tented up to drill 100mil, thermal gap 10mil

### Footprints (pad centres in the part's own frame; a part is rotated, then mirrored left to right if it is on the bottom)
_0603 = smd 0.9 x 0.8: 1 -0.762,0; 2 0.762,0
_0805 = smd 1.2 x 1.3: 1 -1.016,0; 2 1.016,0
0603 = smd 1.1 x 1: 1 -0.85,0; 2 0.85,0
SMADIODE = smd 2 x 2: A 2.223,0; C -2.223,0
1206L = smd 1 x 1.8: 1 -1.4,0; 2 1.4,0
JP2 = drill 0.914 long: 1 -2.54,0; 2 0,0; 3 2.54,0
1X02 = drill 1.016 square: 1 -1.27,0 | drill 1.016 long: 2 1.27,0
1X04 = drill 1.016 long: 1 -3.81,0; 2 -1.27,0; 3 1.27,0; 4 3.81,0
JP1 = drill 0.914 long: 1 0,-1.27; 2 0,1.27
694108106102 = smd 2.4 x 2: 1 11.15,5.5; 1-1 5,5.5; 2 5,-5.5; 3 11.15,-5.5 | hole 1.6: 5,0 | hole 1.8: 9.5,0
PLCC2-MIN = smd 1.5 x 2.3: A -1.524,0; K 1.524,0
1270.1001 = hole 2.4: 13.5,0; 0,0
MSOP12 = smd 0.42 x 0.889: 1 -1.625,-2.105; 2 -0.975,-2.105; 3 -0.325,-2.105; 4 0.325,-2.105; 5 0.975,-2.105; 6 1.625,-2.105; 7 1.625,2.105; 8 0.975,2.105; 9 0.325,2.105; 10 -0.325,2.105; 11 -0.975,2.105; 12 -1.625,2.105
SOT23L = smd 0.55 x 1.2: 1 -0.95,-1.3; 2 0,-1.3; 3 0.95,-1.3; 4 0.95,1.3; 5 -0.95,1.3
HRS_UFL = smd 1.05 x 2.2: GND@1 -1.452,0; GND@2 1.452,0 | smd 1 x 1.05: SIG 0,-1.502
SMA-F-S-TH = drill 1.524: C 0,0 | drill 1.651: G1 -2.54,2.54; G2 2.54,2.54; G3 -2.54,-2.54; G4 2.54,-2.54

### Placement (x,y rotation side)
C1  28.96,33.53 90 top
C2  28.96,29.72 270 top
C3  21.84,6.35 0 top
C4  21.59,19.05 0 top
C5  18.54,60.2 180 top
C6  30.99,88.9 90 top
C7  36.07,87.88 270 top
C8  28.96,88.65 90 top
C9  16.76,48.77 270 top
C10  38.1,88.14 270 top
C11  18.29,44.45 180 top
D1  16.26,59.44 90 top
D2  16,43.69 90 top
D3  14.22,5.59 90 top
D4  14.22,18.29 90 top
D5  25.4,93.98 90 top
D6  21.59,93.98 90 top
F1  23.37,89.15 180 top
JP1  32.77,41.15 90 top
JP2  17.53,35.31 180 top
JP3  34.04,25.91 90 top
JP4  17.53,28.19 180 top
JP5  17.53,95 270 top
JP6  28.45,81.28 0 top
JP7  19.56,48.26 0 top
K1  -1.27,90.93 0 top
LED1  9.65,68.83 0 top
LED2  15.49,68.83 0 top
M1  5.84,68.83 0 top
R1  29.97,41.91 90 top
R2  18.8,32.77 0 top
R3  31.5,24.64 270 top
R4  18.8,25.65 0 top
R5  18.54,6.35 0 top
R6  16,5.59 270 top
R7  18.54,19.05 0 top
R8  16,18.29 270 top
R9  14.48,59.44 270 top
R10  14.22,43.69 270 top
R11  8.89,71.88 0 top
R12  14.73,71.63 0 top
U1  25.15,30.99 180 top
U2  33.53,88.39 180 top
U$1  [OSHW_8MM]  30.61,9.02 0 top
X1  11.18,60.2 90 top
X2  11.18,44.45 90 top
X3  11.18,6.35 90 top
X4  11.18,19.05 90 top
X5  5.08,60.2 0 top
X6  5.08,44.45 0 top
X7  5.08,6.35 180 top
X8  5.08,19.05 180 top

### Tracks (layer width: path | path; a pad name or v marks a point on that pad's centre or on a via)
FILTA
  Top 0.254: U1.1 26.77,33.88 30.23,37.34 30.23,40.89 R1.1
  Top 0.406: R1.1 JP1.2
FILTB
  Top 0.406: R2.1 18.03,32.26 18.54,31.75 22.86,31.75 23.52,32.41 U1.6
  Top 0.61: JP2.2 17.53,33.27 R2.1
GND  (via drill 2.6 pad 5)
  other vias: 38.1,12.95 11.18,12.7 46.23,91.48 15.24,82.55
  pour Top (rank 6): 0,2 50,2 50,98 0,98
IN+
  Top 0.406: U1.3 25.47,34.87 25.91,35.31
  Top 1.1: C5.1 arc-90 25.91,53.59 25.91,35.31 25.91,35.05
N$1
  Top 0.406: LED1.A R11.1
N$2
  Top 0.406: U1.10 25.47,27.11 25.65,26.92
  Top 1.1: C3.2 arc90 25.65,9.4 25.65,26.92 25.65,27.18
N$3
  Top 0.406: LED2.A R12.1
N$4
  Top 0.813: C9.1 JP7.2
N$5
  Top 1.676: D6.C 21.97,91.38 F1.2
N$6
  Top 1.1: R5.2 C3.1
N$7
  Top 0.406: 24.13,35.05 24.82,34.36 U1.4
  Top 1.1: 24.13,35.05 24.13,39.37 arc90 C11.1 19.05,46.48 JP7.1
N$8
  Top 0.406: U1.9 24.82,27.87 23.88,26.92
  Top 1.1: C4.2 arc90 23.88,20.57 23.88,26.92
N$9
  Top 1.1: R7.2 C4.1
N$10
  Top 1.1: X6.C X2.SIG R10.1 16,44.45 D2.2 arc90 16.09,44.45 C11.2
N$12
  Top 1.1: X5.C X1.SIG R9.1 arc-90 14.57,60.29 D1.2 arc90 16.34,60.2 C5.2
N$14
  Top 1.676: K1.1-1 K1.1 10.04,96.27 JP5.1 17.59,96.2 D6.A
OUT1
  Top 1.1: X7.C X3.SIG 14.22,6.35 D3.2 16,6.44 R6.1 R5.1
OUT2
  Top 1.1: X8.C X4.SIG 14.22,19.05 D4.2 16,19.14 R8.1 R7.1
SD1
  Top 0.406: U1.12 30.25,25.4 R3.1 32,25.91 JP3.2
SD2
  Top 0.406: R4.1 17.53,26.16 JP4.2 17.53,29.46 18.29,30.23 22.86,30.23 23.52,29.57 U1.7
V+  (via drill 0.3 pad 0.25, 0.3 pad 0.41)
  Top 0.406: R11.2 v11.18,71.88 | U1.2 26.12,32.3 26.42,32 28.19,32 C1.1
  Top 0.61: C1.1 v27.94,32.77
  Top 0.813: U2.5 34.51,87.12 C7.2
  Top 1.016: C7.2 C10.2
  Bottom 0.406: v11.18,71.88 24.13,78.99 25.65,77.47
  Bottom 0.61: v27.94,32.77 27.94,31.24
  other vias: 34.8,85.6 36.07,85.6 37.34,85.6 38.35,85.6
  pour Bottom (rank 6): 0,2 50,2 50,98 0,98
  pour Top: 34.29,87.63 39.12,87.63 39.12,85.09 34.29,85.09
V_IN
  Top 0.813: C6.2 31.02,89.69 U2.3 32.51,89.76 32.51,90.68 32.77,90.93 34.04,90.93 34.48,90.49 U2.1
  Top 1.27: JP6.1 24.77,83.69 F1.1
  Top 1.422: 25.4,89.79 25.52,89.66 C8.2 C6.2
  Top 1.676: F1.1 25.4,89.79 D5.C
VDD  (via drill 0.3 pad 0.41)
  Top 0.406: U1.11 26.12,30.18 26.42,30.48 C2.1 | R12.2 v17.02,71.63
  Top 1.016: JP6.3 v29.72,75.69 33.78,71.63 33.78,52.07 37.08,48.77 37.08,35.81 34.04,32.77 32.26,32.77 29.97,30.48 C2.1
  Bottom 0.406: v17.02,71.63 25.65,71.63 v29.72,75.69

### Text on the board
tNames: osmo-clock-converter / (C) 2019 by / Harald Welte / Mfg: sysmocom GmbH / OSHW / CC-BY-SA | Version:
bNames: osmo-clock-converter / (C) 2019 by / Harald Welte / Mfg: sysmocom GmbH / OSHW / CC-BY-SA